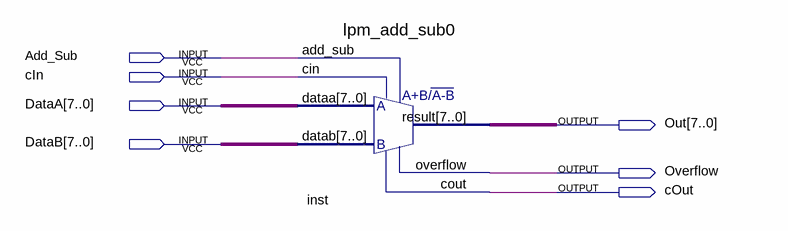
[diagram p0: schematic sheet]
// Quartus schematic Plus_Minus.bdf as structural Verilog: 1 symbols, 7 pins
module Plus_Minus (
  input  Add_Sub,
  input  cIn,
  input  [7:0] DataA,
  input  [7:0] DataB,
  output [7:0] Out,
  output Overflow,
  output cOut
);

  lpm_add_sub0 inst (
    .dataa(DataA), .datab(DataB), .add_sub(Add_Sub), .cin(cIn), .result(Out), .overflow(Overflow), .cout(cOut));
endmodule
